# EasyEDA schematic SCH_ZX WiFi_2022-08-20.json
TITLE: Sheet_1; REV: 1.1; Date: 2022-08-20; Sheet: 1/1; Drawn By: izzx; Company: Your Company
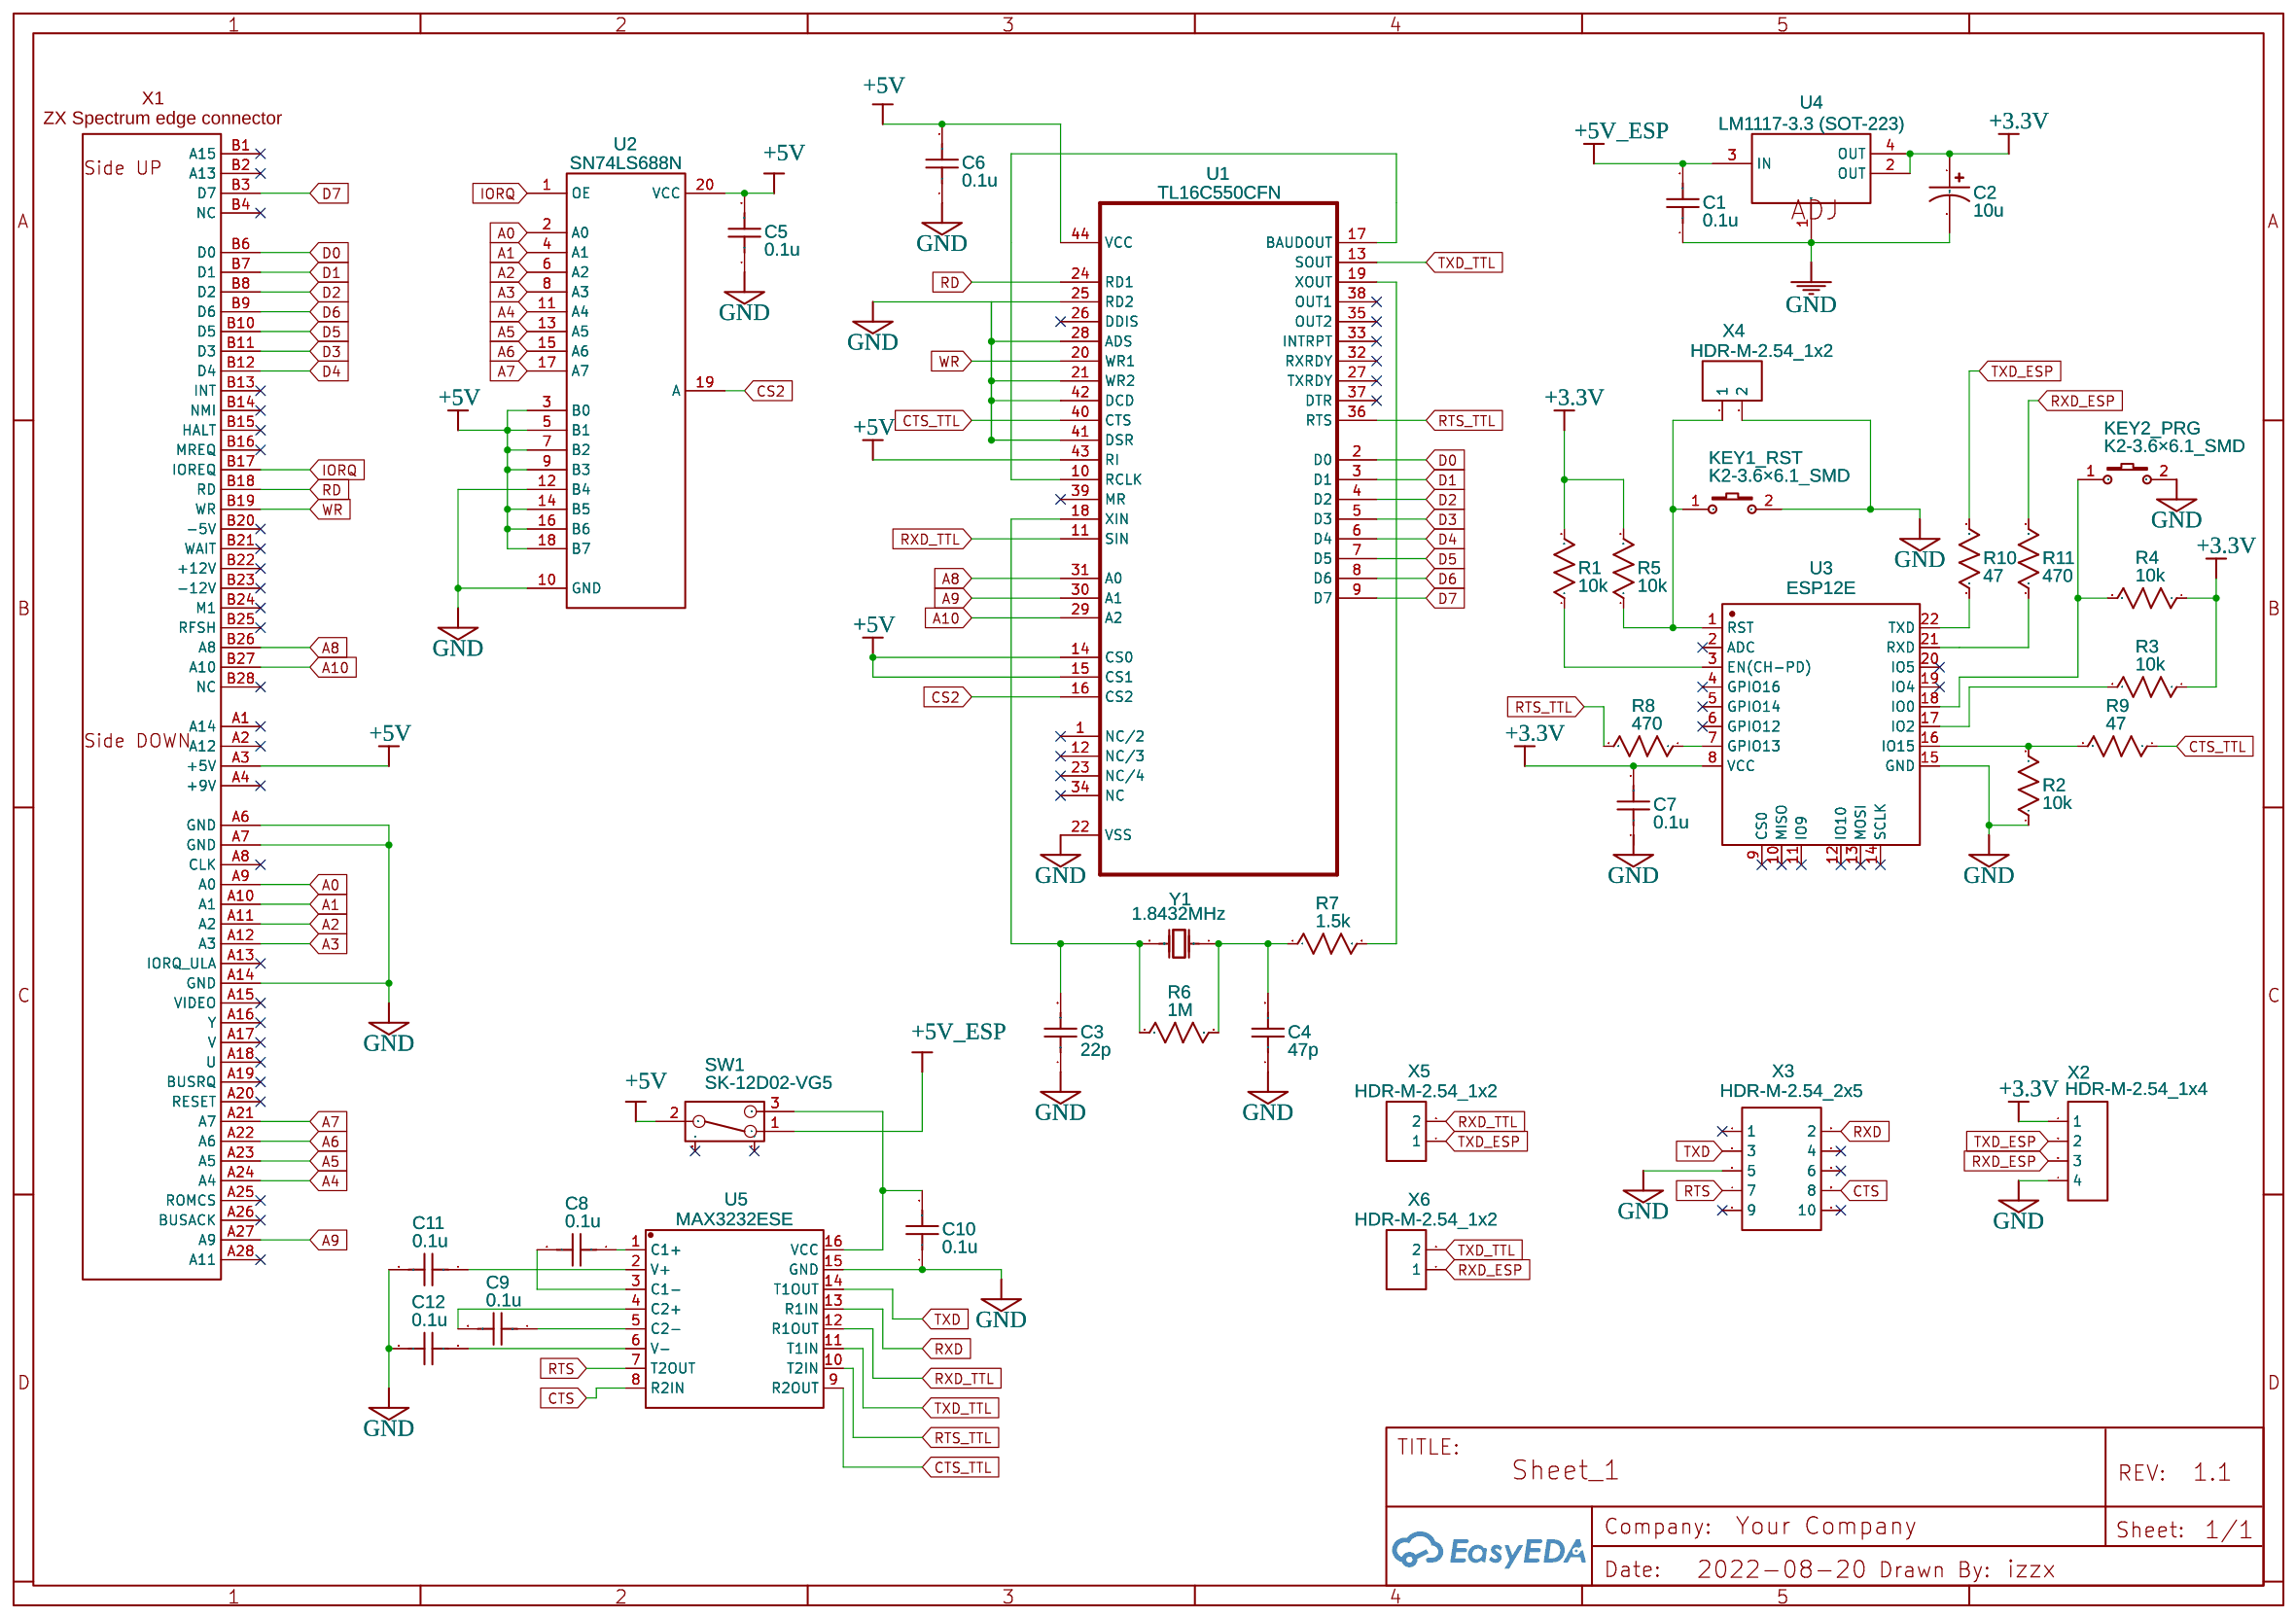
[diagram p0: schematic sheet]

## Parts
C1  0.1u  [C0805]
C2  10u  [CASE-A_3216]
C3  22p  [C0805]
C4  47p  [C0805]
C5  0.1u  [C0805]
C6  0.1u  [C0805]
C7  0.1u  [C0805]
C8  0.1u  [C0805]
C9  0.1u  [C0805]
C10  0.1u  [C0805]
C11  0.1u  [C0805]
C12  0.1u  [C0805]
KEY1_RST  K2-3.6×6.1_SMD  [KEY-SMD_2P-L6.2-W3.6-LS8.0]
KEY2_PRG  K2-3.6×6.1_SMD  [KEY-SMD_2P-L6.2-W3.6-LS8.0]
R1  10k  [R0805]
R2  10k  [R0805]
R3  10k  [R0805]
R4  10k  [R0805]
R5  10k  [R0805]
R6  1M  [R0805]
R7  1.5k  [R0805]
R8  470  [R0805]
R9  47  [R0805]
R10  47  [R0805]
R11  470  [R0805]
SW1  SK-12D02-VG5  [SW-TH_SK-12D02VG3]
U1  TL16C550CFN  [PLCC-44]
U2  SN74LS688N  [DIP20]
U3  ESP12E  [ESP12E/F]
U4  LM1117-3.3 (SOT-223)  [SOT-223-3_L6.5-W3.4-P2.30-LS7.0-BR]
U5  MAX3232ESE  [SOP-16_L9.9-W3.9-P1.27-LS6.0-BL]
X1  ZX SPECTRUM CONNECTOR  [ZX SPECTRUM CONNECTOR]
X2  HDR-M-2.54_1x4  [HDR-M-2.54_1X4]
X3  HDR-M-2.54_2x5  [HDR-M-2.54_2X5]
X4  HDR-M-2.54_1x2  [HDR-M-2.54_1X2]
X5  HDR-M-2.54_1x2  [HDR-M-2.54_1X2]
X6  HDR-M-2.54_1x2  [HDR-M-2.54_1X2]
Y1  1.8432MHz  [OSC-TH_L10.0-W4.5-P5.00]

## Library data of the parts
C1 C3-C12 = C_0805_US: Contributor: LCEDA_Lib
C2 = C_Tan_SMD_A_US: Contributor: LCEDA_Lib
KEY1_RST KEY2_PRG = K2-3.6×6.1_SMD: Supplier Part: C118141; Supplier: LCSC; Manufacturer Part: K2-1107ST-A4SW-06; Contributor: LCEDA_Lib; 制造商: 韩国韩荣
R1-R11 = R_0805_US: Contributor: LCEDA_Lib
SW1 = SK-12D02-VG5: Supplier: LCSC; Supplier Part: C136722; Manufacturer: Rectangular Connectors - Contacts; Contributor: LCSC
U1 = TL16C550CFN
U2 = SN74LS688N: 8-Bit Magnitude Comparator
U3 = ESP12E/F: Contributor: cpu76239
U4 = LM317(SOT-223): Supplier: LCSC; Manufacturer: UTC; Manufacturer Part: LM317G-AA3-R; Supplier Part: C19651; Paste Type: expand; Contributor: LCEDA_Lib
U5 = MAX3232ESE: Supplier: LCSC; Supplier Part: C2904738; Manufacturer: UMW(友台半导体); Contributor: LCSC; JLCPCB Part Class: Extended Part
X1 = ZX SPECTRUM CONNECTOR: Contributor: cliff1024
X2 = HDR-M-2.54_1x4: Supplier Part: C124378; Supplier: LCSC; Contributor: LCEDA_Lib
X3 = HDR-M-2.54_2x5: Supplier Part: C178292; Supplier: LCSC; Contributor: LCEDA_Lib
X4-X6 = HDR-M-2.54_1x2: Supplier Part: C124375; Supplier: LCSC; Contributor: LCEDA_Lib
Y1 = X49UD3579MSD2SC: Supplier: LCSC; Manufacturer: ValuePro; Supplier Part: C36564

## Nets
+3.3V: C2.1 C7.2 R1.2 R3.1 R4.1 R5.2 U3.8(VCC) U4.2(OUT) U4.4(OUT) X2.1
+5V: C5.2 C6.2 SW1.2 U1.14(CS0) U1.15(CS1) U1.43(RI) U1.44(VCC) U2.3(B0) U2.5(B1) U2.7(B2) U2.9(B3) U2.14(B5) U2.16(B6) U2.18(B7) U2.20(VCC) X1.A3(+5V)
+5V_ESP: C1.2 SW1.1 U4.3(IN)
GND: C1.1 C2.2 C3.1 C4.1 C5.1 C6.1 C7.1 C10.1 C11.2 C12.2 KEY1_RST.2 KEY2_PRG.2 R2.1 U1.21(WR2) U1.22(VSS) U1.25(RD2) U1.28(ADS) U1.41(DSR) U1.42(DCD) U2.10(GND) U2.12(B4) U3.15(GND) U4.1(ADJ) U5.15(GND) X1.A6(GND) X1.A7(GND) X1.A14(GND) X2.4 X3.5 X4.2
A0: U2.2(A0) X1.A9(A0)
A1: U2.4(A1) X1.A10(A1)
A2: U2.6(A2) X1.A11(A2)
A3: U2.8(A3) X1.A12(A3)
A4: U2.11(A4) X1.A24(A4)
A5: U2.13(A5) X1.A23(A5)
A6: U2.15(A6) X1.A22(A6)
A7: U2.17(A7) X1.A21(A7)
A8: U1.31(A0) X1.B26(A8)
A9: U1.30(A1) X1.A27(A9)
A10: U1.29(A2) X1.B27(A10)
CS2: U1.16(CS2) U2.19(A)
CTS: U5.8(R2IN) X3.8
CTS_TTL: R9.1 U1.40(CTS) U5.9(R2OUT)
D0: U1.2(D0) X1.B6(D0)
D1: U1.3(D1) X1.B7(D1)
D2: U1.4(D2) X1.B8(D2)
D3: U1.5(D3) X1.B11(D3)
D4: U1.6(D4) X1.B12(D4)
D5: U1.7(D5) X1.B10(D5)
D6: U1.8(D6) X1.B9(D6)
D7: U1.9(D7) X1.B3(D7)
IORQ: U2.1(OE) X1.B17(IOREQ)
RD: U1.24(RD1) X1.B18(RD)
RTS: U5.7(T2OUT) X3.7
RTS_TTL: R8.2 U1.36(RTS) U5.10(T2IN)
RXD: U5.13(R1IN) X3.2
RXD_ESP: R11.2 X2.3 X6.1
RXD_TTL: U1.11(SIN) U5.12(R1OUT) X5.2
TXD: U5.14(T1OUT) X3.3
TXD_ESP: R10.2 X2.2 X5.1
TXD_TTL: U1.13(SOUT) U5.11(T1IN) X6.2
WR: U1.20(WR1) X1.B19(WR)
Net-(C3-2): C3.2 R6.1 U1.18(XIN) Y1.2(OSC2)
Net-(C4-2): C4.2 R6.2 R7.1 Y1.1(OSC1)
Net-(C8-1): C8.1 U5.1(C1+)
Net-(C8-2): C8.2 U5.3(C1-)
Net-(C9-1): C9.1 U5.5(C2-)
Net-(C9-2): C9.2 U5.4(C2+)
Net-(C10-2): C10.2 SW1.3 U5.16(VCC)
Net-(C11-1): C11.1 U5.2(V+)
Net-(C12-1): C12.1 U5.6(V-)
Net-(KEY1_RST-1): KEY1_RST.1 R5.1 U3.1(RST) X4.1
Net-(KEY2_PRG-1): KEY2_PRG.1 R4.2 U3.18(IO0)
Net-(R1-1): R1.1 U3.3(EN(CH-PD))
Net-(R2-2): R2.2 R9.2 U3.16(IO15)
Net-(R3-2): R3.2 U3.17(IO2)
Net-(R7-2): R7.2 U1.19(XOUT)
Net-(R8-1): R8.1 U3.7(GPIO13)
Net-(R10-1): R10.1 U3.22(TXD)
Net-(R11-1): R11.1 U3.21(RXD)
Net-(U1-10): U1.10(RCLK) U1.17(BAUDOUT)

Not connected (* = marked no-connect by the designer): SW1 4* 5*; U1 1(NC/2)* 12(NC/3)* 23(NC/4)* 26(DDIS)* 27(TXRDY)* 32(RXRDY)* 33(INTRPT)* 34(NC)* 35(OUT2)* 37(DTR)* 38(OUT1)* 39(MR)*; U3 2(ADC)* 4(GPIO16)* 5(GPIO14)* 6(GPIO12)* 9(CS0)* 10(MISO)* 11(IO9)* 12(IO10)* 13(MOSI)* 14(SCLK)* 19(IO4)* 20(IO5)*; X1 A1(A14)* A2(A12)* A4(+9V)* A8(CLK)* A13(IORQ_ULA)* A15(VIDEO)* A16(Y)* A17(V)* A18(U)* A19(BUSRQ)* A20(RESET)* A25(ROMCS)* A26(BUSACK)* A28(A11)* B1(A15)* B2(A13)* B4(NC)* B13(INT)* B14(NMI)* B15(HALT)* B16(MREQ)* B20(-5V)* B21(WAIT)* B22(+12V)* B23(-12V)* B24(M1)* B25(RFSH)* B28(NC)*; X3 1* 4* 6* 9* 10*
